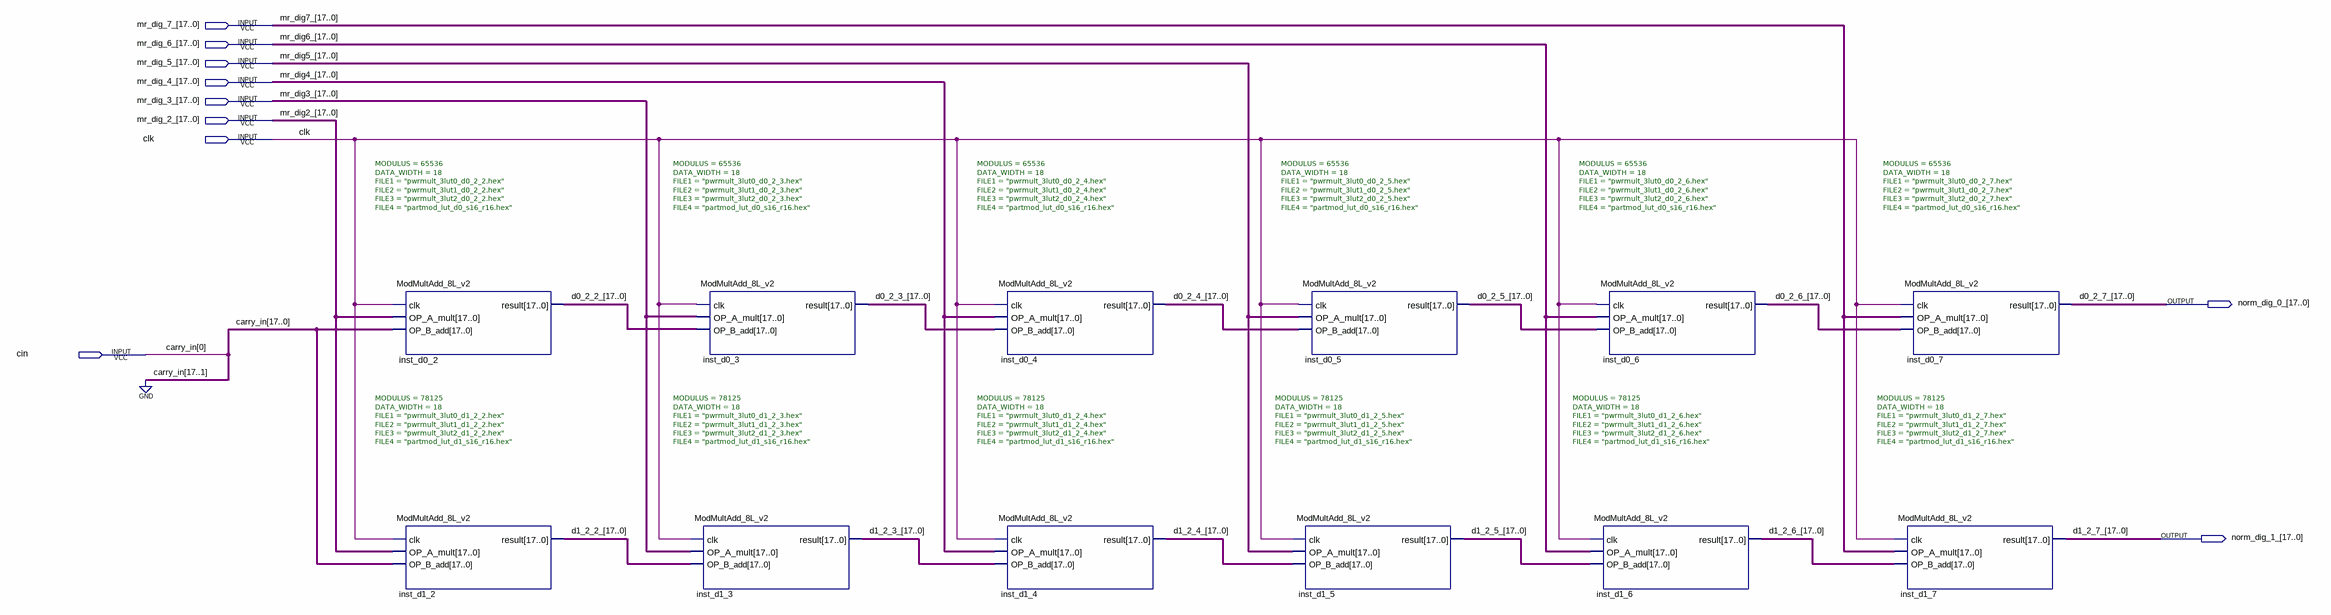
[diagram p0: schematic sheet]
// Quartus schematic Recomp_pipe_mlab_x2.bdf as structural Verilog: 12 symbols, 10 pins
module Recomp_pipe_mlab_x2 (
  input  [17:0] mr_dig_7_,
  input  [17:0] mr_dig_6_,
  input  [17:0] mr_dig_5_,
  input  [17:0] mr_dig_4_,
  input  [17:0] mr_dig_3_,
  input  [17:0] mr_dig_2_,
  input  clk,
  input  cin,
  output [17:0] norm_dig_0_,
  output [17:0] norm_dig_1_
);

  wire [17:0] d0_2_2_, d0_2_3_, d0_2_4_, d0_2_5_, d0_2_6_, d1_2_2_, d1_2_3_, d1_2_4_, d1_2_5_, d1_2_6_;

  ModMultAdd_8L_v2 #(.MODULUS(65536), .DATA_WIDTH(18), .FILE1("pwrmult_3lut0_d0_2_2.hex"), .FILE2("pwrmult_3lut1_d0_2_2.hex"), .FILE3("pwrmult_3lut2_d0_2_2.hex"), .FILE4("partmod_lut_d0_s16_r16.hex")) inst_d0_2 (
    .clk(clk), .OP_A_mult(mr_dig_2_), .OP_B_add({{17{1'b0}}, cin}), .result(d0_2_2_));
  ModMultAdd_8L_v2 #(.MODULUS(78125), .DATA_WIDTH(18), .FILE1("pwrmult_3lut0_d1_2_2.hex"), .FILE2("pwrmult_3lut1_d1_2_2.hex"), .FILE3("pwrmult_3lut2_d1_2_2.hex"), .FILE4("partmod_lut_d1_s16_r16.hex")) inst_d1_2 (
    .clk(clk), .OP_A_mult(mr_dig_2_), .OP_B_add({{17{1'b0}}, cin}), .result(d1_2_2_));
  ModMultAdd_8L_v2 #(.MODULUS(65536), .DATA_WIDTH(18), .FILE1("pwrmult_3lut0_d0_2_3.hex"), .FILE2("pwrmult_3lut1_d0_2_3.hex"), .FILE3("pwrmult_3lut2_d0_2_3.hex"), .FILE4("partmod_lut_d0_s16_r16.hex")) inst_d0_3 (
    .clk(clk), .OP_A_mult(mr_dig_3_), .OP_B_add(d0_2_2_), .result(d0_2_3_));
  ModMultAdd_8L_v2 #(.MODULUS(78125), .DATA_WIDTH(18), .FILE1("pwrmult_3lut0_d1_2_3.hex"), .FILE2("pwrmult_3lut1_d1_2_3.hex"), .FILE3("pwrmult_3lut2_d1_2_3.hex"), .FILE4("partmod_lut_d1_s16_r16.hex")) inst_d1_3 (
    .clk(clk), .OP_A_mult(mr_dig_3_), .OP_B_add(d1_2_2_), .result(d1_2_3_));
  ModMultAdd_8L_v2 #(.MODULUS(65536), .DATA_WIDTH(18), .FILE1("pwrmult_3lut0_d0_2_4.hex"), .FILE2("pwrmult_3lut1_d0_2_4.hex"), .FILE3("pwrmult_3lut2_d0_2_4.hex"), .FILE4("partmod_lut_d0_s16_r16.hex")) inst_d0_4 (
    .clk(clk), .OP_A_mult(mr_dig_4_), .OP_B_add(d0_2_3_), .result(d0_2_4_));
  ModMultAdd_8L_v2 #(.MODULUS(78125), .DATA_WIDTH(18), .FILE1("pwrmult_3lut0_d1_2_4.hex"), .FILE2("pwrmult_3lut1_d1_2_4.hex"), .FILE3("pwrmult_3lut2_d1_2_4.hex"), .FILE4("partmod_lut_d1_s16_r16.hex")) inst_d1_4 (
    .clk(clk), .OP_A_mult(mr_dig_4_), .OP_B_add(d1_2_3_), .result(d1_2_4_));
  ModMultAdd_8L_v2 #(.MODULUS(65536), .DATA_WIDTH(18), .FILE1("pwrmult_3lut0_d0_2_5.hex"), .FILE2("pwrmult_3lut1_d0_2_5.hex"), .FILE3("pwrmult_3lut2_d0_2_5.hex"), .FILE4("partmod_lut_d0_s16_r16.hex")) inst_d0_5 (
    .clk(clk), .OP_A_mult(mr_dig_5_), .OP_B_add(d0_2_4_), .result(d0_2_5_));
  ModMultAdd_8L_v2 #(.MODULUS(78125), .DATA_WIDTH(18), .FILE1("pwrmult_3lut0_d1_2_5.hex"), .FILE2("pwrmult_3lut1_d1_2_5.hex"), .FILE3("pwrmult_3lut2_d1_2_5.hex"), .FILE4("partmod_lut_d1_s16_r16.hex")) inst_d1_5 (
    .clk(clk), .OP_A_mult(mr_dig_5_), .OP_B_add(d1_2_4_), .result(d1_2_5_));
  ModMultAdd_8L_v2 #(.MODULUS(65536), .DATA_WIDTH(18), .FILE1("pwrmult_3lut0_d0_2_6.hex"), .FILE2("pwrmult_3lut1_d0_2_6.hex"), .FILE3("pwrmult_3lut2_d0_2_6.hex"), .FILE4("partmod_lut_d0_s16_r16.hex")) inst_d0_6 (
    .clk(clk), .OP_A_mult(mr_dig_6_), .OP_B_add(d0_2_5_), .result(d0_2_6_));
  ModMultAdd_8L_v2 #(.MODULUS(78125), .DATA_WIDTH(18), .FILE1("pwrmult_3lut0_d1_2_6.hex"), .FILE2("pwrmult_3lut1_d1_2_6.hex"), .FILE3("pwrmult_3lut2_d1_2_6.hex"), .FILE4("partmod_lut_d1_s16_r16.hex")) inst_d1_6 (
    .clk(clk), .OP_A_mult(mr_dig_6_), .OP_B_add(d1_2_5_), .result(d1_2_6_));
  ModMultAdd_8L_v2 #(.MODULUS(65536), .DATA_WIDTH(18), .FILE1("pwrmult_3lut0_d0_2_7.hex"), .FILE2("pwrmult_3lut1_d0_2_7.hex"), .FILE3("pwrmult_3lut2_d0_2_7.hex"), .FILE4("partmod_lut_d0_s16_r16.hex")) inst_d0_7 (
    .clk(clk), .OP_A_mult(mr_dig_7_), .OP_B_add(d0_2_6_), .result(norm_dig_0_));
  ModMultAdd_8L_v2 #(.MODULUS(78125), .DATA_WIDTH(18), .FILE1("pwrmult_3lut0_d1_2_7.hex"), .FILE2("pwrmult_3lut1_d1_2_7.hex"), .FILE3("pwrmult_3lut2_d1_2_7.hex"), .FILE4("partmod_lut_d1_s16_r16.hex")) inst_d1_7 (
    .clk(clk), .OP_A_mult(mr_dig_7_), .OP_B_add(d1_2_6_), .result(norm_dig_1_));

  // Other names for the same wires on the sheet: carry_in[0] = cin; d0_2_7_[17:0] = norm_dig_0_;
  //   d1_2_7_[17:0] = norm_dig_1_; mr_dig2_[17:0] = mr_dig_2_; mr_dig3_[17:0] = mr_dig_3_; mr_dig4_[17:0] = mr_dig_4_;
  //   mr_dig5_[17:0] = mr_dig_5_; mr_dig6_[17:0] = mr_dig_6_; mr_dig7_[17:0] = mr_dig_7_
endmodule
